# Altium project Attiny.PrjPcb
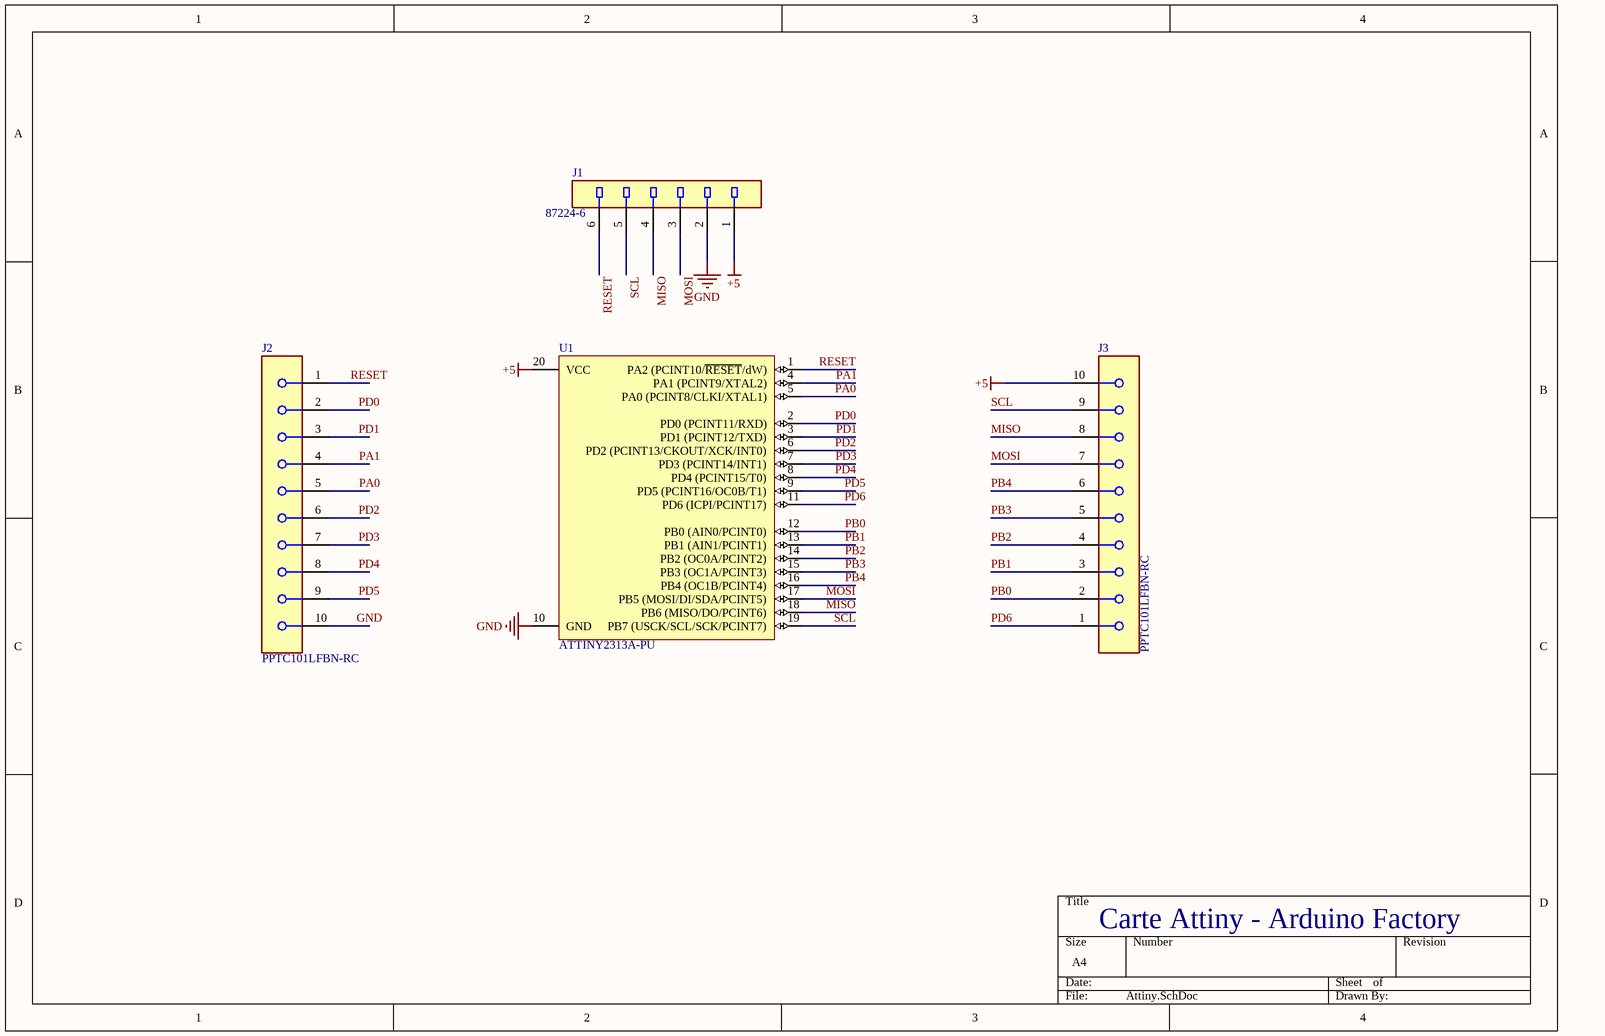
[diagram p0: Attiny.SchDoc]
1 sheet, 4 parts. Net scope: global (net labels, ports and power ports of the same name join across sheets).
Board file: Attiny.PcbDoc

## Sheet Attiny.SchDoc
size A4; SheetNumber: 1; SheetTotal: 1

### Parts
J1  Part Number: 87224-6  [TE_87224-6_0]  (hidden comment: Conn_TE_87224-6_eec)
J2  Part Number: PPTC101LFBN-RC  [Sullins_PPTC101LFBN-RC_0]  (hidden comment: Conn_Sullins_PPTC101LFBN-RC_eec)
J3  Part Number: PPTC101LFBN-RC  [Sullins_PPTC101LFBN-RC_0]  (hidden comment: Conn_Sullins_PPTC101LFBN-RC_eec)
U1  ATTINY2313A-PU  [20P3]

### Nets
+5: J1.1 J3.10 U1.20(VCC)
GND: J1.2 J2.10 U1.10(GND)
MISO: J1.4 J3.8 U1.18(PB6_(MISO/DO/PCINT6))
MOSI: J1.3 J3.7 U1.17(PB5_(MOSI/DI/SDA/PCINT5))
PA0: J2.5 U1.5(PA0_(PCINT8/CLKI/XTAL1))
PA1: J2.4 U1.4(PA1_(PCINT9/XTAL2))
PB0: J3.2 U1.12(PB0_(AIN0/PCINT0))
PB1: J3.3 U1.13(PB1_(AIN1/PCINT1))
PB2: J3.4 U1.14(PB2_(OC0A/PCINT2))
PB3: J3.5 U1.15(PB3_(OC1A/PCINT3))
PB4: J3.6 U1.16(PB4_(OC1B/PCINT4))
PD0: J2.2 U1.2(PD0_(PCINT11/RXD))
PD1: J2.3 U1.3(PD1_(PCINT12/TXD))
PD2: J2.6 U1.6(PD2_(PCINT13/CKOUT/XCK/INT0))
PD3: J2.7 U1.7(PD3_(PCINT14/INT1))
PD4: J2.8 U1.8(PD4_(PCINT15/T0))
PD5: J2.9 U1.9(PD5_(PCINT16/OC0B/T1))
PD6: J3.1 U1.11(PD6_(ICPI/PCINT17))
RESET: J1.6 J2.1 U1.1(PA2_(PCINT10/~{RESET}/dW))
SCL: J1.5 J3.9 U1.19(PB7_(USCK/SCL/SCK/PCINT7))

### Notes on the sheet
- Carte Attiny - Arduino Factory

### Library data of the parts
J1 = Conn_TE_87224-6_eec: CONN HEADER VERT .100 6POS 15AU; Manufacturer: TE; number of positions: 6; helpURL: https://upverter.com/upn/revision/5cdf6967ba71a8d5/; ComponentLink2Description: Datasheet; Temperature: -65°C to +105°C; Package: CONN_PTH_HDR6; Supplier 2: Mouser; Price: 2.04212257321; Supplier 1: Digi-Key; ComponentLink1URL: https://upverter.com/upn/revision/5cdf6967ba71a8d5/; Supplier Part Number 2: 571-872246; Supplier Part Number 1: A26551-ND; ComponentLink1Description: Upverter; ComponentLink2URL: http://www.te.com/commerce/DocumentDelivery/DDEController?Action=srchrtrv&DocNm=87224&DocType=Customer+Drawing&DocLang=English; RoHS: TRUE; Mouser Part Number: 571-872246; Ipc Land Pattern Name: HDRV6W64P254_1X6_1483X64X229; Temperature Range High: +105°C; Digikey Description: CONN HEADER VERT .100 6POS 15AU; Digikey Part Number: A26551-ND; Lead Free: yes; Temperature Range Low: -65°C
J2 J3 = Conn_Sullins_PPTC101LFBN-RC_eec: CONN HEADER FEMALE 10POS.1" TIN; Category Bda670Ac885E6661: Uncategorized; Category E7012A0Bd22E3Cc6: Headers & Receptacles; contact_material: Phosphor Bronze; pin_pitch: 2.54 mm; Is Female: yes; number_of_rows: 1; Category 75Fab8F04590Ae3D: Connectors and Adapters; number_of_positions: 10; Symbol 0 0: Standard; Category 0836C53C3D42D3F1: Connectors; helpURL: https://upverter.com/upn/revision/438243a39a4aeeed/; ComponentLink2Description: Datasheet; Temperature: -40°C to +105°C; Package: HDR10; Supplier 2: Mouser; Price: 0.506714616829; Supplier 1: Digi-Key; ComponentLink1URL: https://upverter.com/upn/revision/438243a39a4aeeed/; Supplier Part Number 1: S7008-ND; Manufacturer: Sullins; ComponentLink1Description: Upverter; ComponentLink2URL: http://www.sullinscorp.com/drawings/78_P(N)PxCxxxLFBN-RC,_10492-H.pdf; RoHS: TRUE; Temperature Range High: +105°C; Octopart Part Number: a3ed6ae3a4397c2a; Digikey Description: CONN HEADER FEMALE 10POS.1" TIN; Digikey Part Number: S7008-ND; Category A3C16Ecb93907806: Uncategorized; Type: integrated circuit; Lead Free: yes; Temperature Range Low: -40°C; Mounting Type: through hole; Num Pins: 10; housing_material: Plastic
U1 = ATTINY2313A-PU: 8-bit AVR Microcontroller, 1.8-5.5V, 2KB Flash, 128 Bytes EEPROM, 128 Bytes SRAM, 20-pin PDIP, Industrial Grade (-40°C to 85°C), Pb-Free; Code_JEDEC: MS-001-AD; PackageVersion: revC, Jan-2004; DatasheetVersion: revA, Dec-2009; PackageDescription: 20-lead (0.300"/7.62mm Wide) Plastic Dual Inline Package (PDIP); PackageReference: 20P3; PartNumber: ATTINY2313A-PU